# EAGLE design pic_k42 (EAGLE 9.6.2)
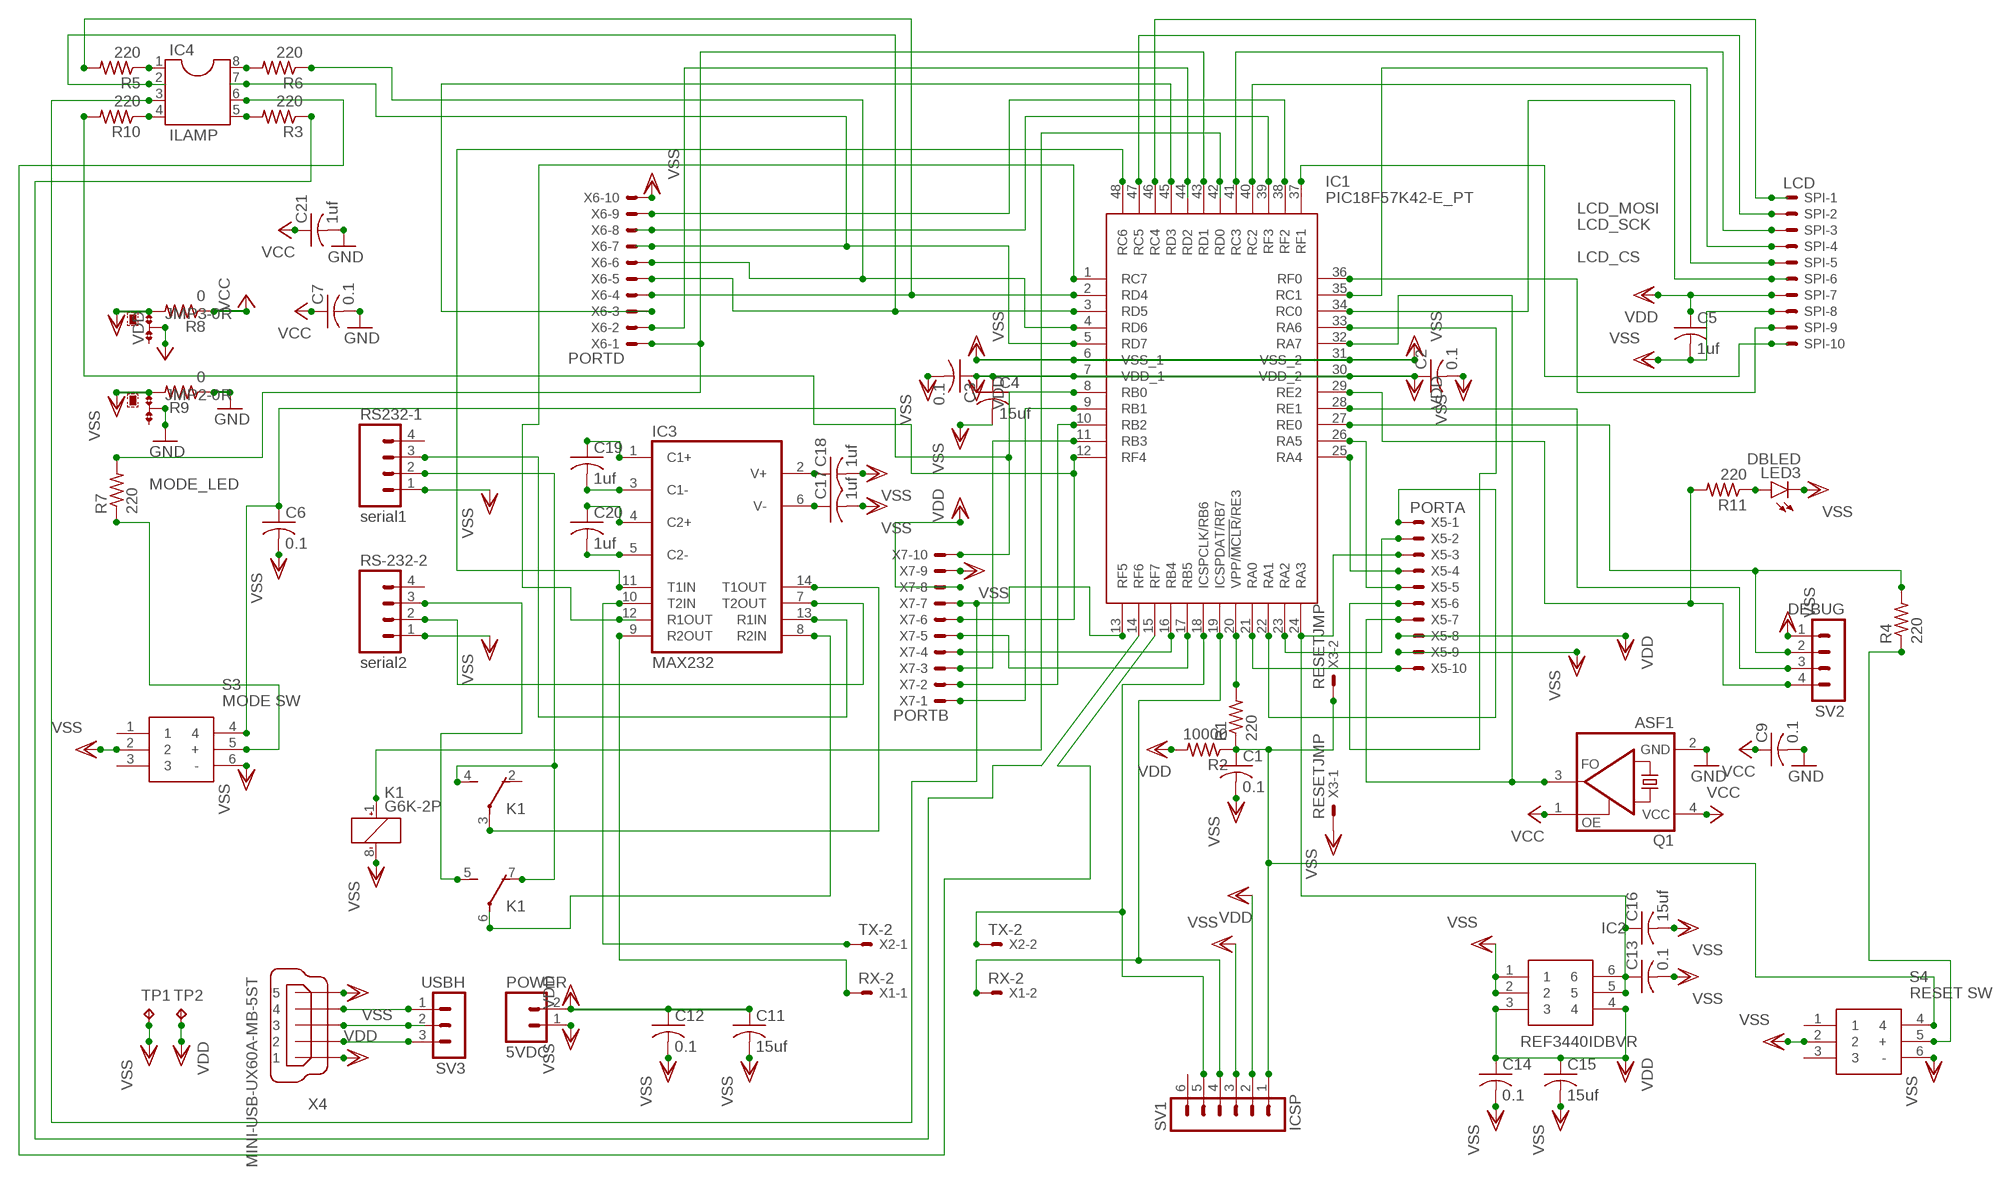
[diagram p0: schematic, sheet 1]

## Parts
C1  0.1  C-USC1206  [C1206]
C2  0.1  C-USC1206  [C1206]
C3  0.1  C-USC1206  [C1206]
C4  15uf  C-USC1206  [C1206]
C5  1uf  C-USC0805  [C0805]
C6  0.1  C-USC1206  [C1206]
C7  0.1  C-USC1206  [C1206]
C9  0.1  C-USC1206  [C1206]
C11  15uf  C-USC1206  [C1206]
C12  0.1  C-USC1206  [C1206]
C13  0.1  C-USC1206  [C1206]
C14  0.1  C-USC1206  [C1206]
C15  15uf  C-USC1206  [C1206]
C16  15uf  C-USC1206  [C1206]
C17  1uf  C-USC0805  [C0805]
C18  1uf  C-USC0805  [C0805]
C19  1uf  C-USC0805  [C0805]
C20  1uf  C-USC0805  [C0805]
C21  1uf  C-USC0805  [C0805]
IC1  PIC18F57K42-E_PT  [QFP50P900X900X120-48N]
IC2  REF3440IDBVR  [SOP95P280X145-6N]
IC3  MAX232  [DIL16]
IC4  ILAMP  DIL8S  [SOCKET-08]
JMP2  0R-JUMPA  [A0R-JMP]
JMP3  0R-JUMPA  [A0R-JMP]
K1  G6K-2P  [G6K-2P]
LED3  DBLED  LEDCHIPLED_1206  [CHIPLED_1206]
POWER  5VDC  M02  [02P]
Q1  ASF1  [ASF]
R1  220  R-US_R1206  [R1206]
R2  10000  R-US_R1206  [R1206]
R3  220  R-US_R1206  [R1206]
R4  220  R-US_R1206  [R1206]
R5  220  R-US_R1206  [R1206]
R6  220  R-US_R1206  [R1206]
R7  220  R-US_R1206  [R1206]
R8  0  R-US_R1206  [R1206]
R9  0  R-US_R1206  [R1206]
R10  220  R-US_R1206  [R1206]
R11  220  R-US_R1206  [R1206]
RS232-1  serial1  M04  [04P]
RS-232-2  serial2  M04  [04P]
S3  MODE SW  B3W-9000-Y1N  [B3W-9_1-LED]
S4  RESET SW  B3W-9000-Y1N  [B3W-9_1-LED]
SPI  LCD  22-23-2101  [22-23-2101]
SV1  ICSP  MA06-1  [MA06-1]
SV2  DEBUG  MA04-1  [MA04-1]
SV3  USBH  MA03-1  [MA03-1]
TP1  TPB1,27  [B1,27]
TP2  TPB1,27  [B1,27]
X1  RX-2  332-02  [332-02]
X2  TX-2  332-02  [332-02]
X3  RESETJMP  332-02  [332-02]
X4  MINI-USB-UX60A-MB-5ST  [UX60A-MB-5ST]
X5  PORTA  22-23-2101  [22-23-2101]
X6  PORTD  22-23-2101  [22-23-2101]
X7  PORTB  22-23-2101  [22-23-2101]

## Nets
GND: C7.2 C9.2 C21.2 JMP2.2 Q1.2(GND) R9.1
LCD_CS: IC1.40(RC2) SPI.5
LCD_MOSI: IC1.47(RC5) SPI.2
LCD_SCK: IC1.41(RC3) SPI.3
MODE_LED: IC1.43(RD1) R7.2 X6.1
N$1: C1.1 R1.1 R2.1 S4.4 SV1.1 X3.2
N$2: IC1.20(VPP/!MCLR!/RE3) R1.2
N$3: IC4.1 R5.1
N$4: IC1.32(RA7) Q1.3(FO) X5.7
N$5: C17.1 IC3.6(V-)
N$6: IC1.19(ICSPDAT/RB7) SV1.4 X1.2
N$7: IC1.18(ICSPCLK/RB6) SV1.5 X2.2
N$8: C13.1 C16.1 IC1.24(RA3) IC2.5 IC2.6 X5.3
N$9: C18.1 IC3.2(V+)
N$10: C19.1 IC3.1(C1+)
N$11: C20.1 IC3.4(C2+)
N$12: C20.2 IC3.5(C2-)
N$13: C19.2 IC3.3(C1-)
N$14: K1.4(2:S) K1.7(3:O) RS232-1.2
N$15: IC3.7(T2OUT) RS-232-2.2
N$16: IC3.13(R1IN) RS232-1.3
N$17: IC4.8 R6.2
N$18: IC1.1(RC7) IC3.12(R1OUT)
N$19: IC3.9(R2OUT) X1.1
N$20: IC1.48(RC6) IC3.11(T1IN)
N$21: R4.1 S4.5(+)
N$22: IC3.10(T2IN) X2.1
N$23: IC1.27(RE0) R4.2 SV2.2
N$24: IC1.28(RE1) SV2.3
N$25: IC1.29(RE2) R11.2 SV2.4
N$26: IC3.14(T1OUT) K1.3(2:P)
N$27: IC3.8(R2IN) K1.6(3:P)
N$28: IC1.42(RD0) K1.1(1:+)
N$29: IC1.46(RC4) SPI.1
N$32: IC1.35(RC1) SPI.4
N$34: IC1.34(RC0) SPI.6
N$35: IC1.26(RA5) X5.5
N$36: IC1.25(RA4) X5.4
N$37: IC1.23(RA2) X5.2
N$38: IC1.22(RA1) X5.1
N$39: IC1.21(RA0) X5.10
N$40: IC1.33(RA6) X5.6
N$41: IC1.36(RF0) SPI.9
N$42: IC1.37(RF1) SPI.10
N$43: C6.1 IC1.8(RB0) S3.4 X7.10
N$44: IC1.44(RD2) X6.2
N$45: IC1.45(RD3) X6.3
N$46: IC1.2(RD4) R5.2 X6.4
N$47: IC1.3(RD5) IC4.2 X6.5
N$48: IC1.4(RD6) R6.1 X6.6
N$49: IC1.5(RD7) IC4.7 X6.7
N$50: IC1.38(RF2) X6.9
N$51: IC1.39(RF3) X6.8
N$53: IC1.9(RB1) X7.1
N$54: IC1.10(RB2) X7.2
N$55: IC4.5 R3.2
N$56: IC1.16(RB4) X7.4
N$57: IC1.17(RB5) X7.5
N$58: IC1.12(RF4) R10.2 X7.6
N$59: IC1.13(RF5) IC4.3 X7.7
N$60: IC1.15(RF7) IC4.6
N$61: IC1.14(RF6) R3.1
N$62: K1.5(3:S) RS-232-2.3
N$63: IC4.4 R10.1
N$64: R7.1 S3.5(+)
N$65: LED3.A R11.1
N$66: IC1.11(RB3) X7.3
N$67: SV3.1 X4.4
N$68: SV3.2 X4.3
N$69: SV3.3 X4.2
VCC: C7.1 C9.1 C21.1 JMP3.2 Q1.1(OE) Q1.4(VCC) R8.1
VDD: C2.1 C3.1 C4.1 C5.1 C11.1 C12.1 C14.1 C15.1 IC1.7(VDD_1) IC1.30(VDD_2) IC2.3 IC2.4 JMP3.1 POWER.2 R2.2 R8.2 SPI.7 SV1.2 TP2.TP X4.1 X5.8 X7.8
VSS: C1.2 C2.2 C3.2 C4.2 C5.2 C6.2 C11.2 C12.2 C13.2 C14.2 C15.2 C16.2 C17.2 C18.2 IC1.6(VSS_1) IC1.31(VSS_2) IC2.1 IC2.2 JMP2.1 K1.8(1:-) LED3.C POWER.1 R9.2 RS232-1.1 RS-232-2.1 S3.2 S3.6(-) S4.2 S4.6(-) SPI.8 SV1.3 SV2.1 TP1.TP X3.1 X4.5 X5.9 X6.10 X7.9
Unconnected: JMP2.3 JMP3.3 K1.2(2:O) RS232-1.4 RS-232-2.4 S3.1 S3.3 S4.1 S4.3 SV1.6

## Power pins joined to a net without a drawn wire
GND: IC3.15(GND)
VCC: IC3.16(VCC)

## Library data of the parts
C1-C7 C9 C11-C21 = rcl:C-US: CAPACITOR, American symbol; SPICEPREFIX: C
IC1 = SamacSys_Parts:PIC18F57K42-E_PT: 8-bit Microcontrollers - MCU 128KB Flash, 8KB RAM, 256B EEPROM, 12-bit ADC2, Vector Interrupts, DMA, MAP, DIA, DAC, Comp, PWM, CWG, HLT, WWDT, SCAN/CRC, ZCD, PPS, EUSART, SPI/I2C, IDLE/DOZE/PMD Source: Datasheet; DESCRIPTION: 8-bit Microcontrollers - MCU 128KB Flash, 8KB RAM, 256B EEPROM, 12-bit ADC2, Vector Interrupts, DMA, MAP, DIA, DAC, Comp, PWM, CWG, HLT, WWDT, SCAN/CRC, ZCD, PPS, EUSART, SPI/I2C, IDLE/DOZE/PMD; HEIGHT: 1.2mm; MANUFACTURER_NAME: Microchip; MANUFACTURER_PART_NUMBER: PIC18F57K42-E/PT; MOUSER_PART_NUMBER: 579-PIC18F57K42-E/PT
IC2 = SamacSys_Parts:REF3440IDBVR: 4.1V Low-Drift Low-Power Small-Footprint Series Voltage Reference Source: Datasheet; DESCRIPTION: 4.1V Low-Drift Low-Power Small-Footprint Series Voltage Reference; HEIGHT: 1.45mm; MANUFACTURER_NAME: Texas Instruments; MANUFACTURER_PART_NUMBER: REF3440IDBVR
IC3 = maxim:MAX232: RS232 TRANSCEIVER; MF: MAXIM; MPN: MAX232ACPE+; OC_FARNELL: 9723773; OC_NEWARK: 68K4544
IC4 = ic-package:DIL8: Dual In Line / Socket
JMP2 JMP3 = jump-0r-smd:0R-JUMP: SMD 0R 0805 Jumper
K1 = relay:G6K: Low Signal Relay oeiwcsnts1.omron.com/.. D20G6K0100.pdf; MF: OMRON COMPONENTS USA; MPN: G6K-2P DC3; OC_FARNELL: 3937276; OC_NEWARK: 89C6482
LED3 = led:LED: LED OSRAM: - CHIPLED LG R971, LG N971, LY N971, LG Q971, LY Q971, LO R971, LY R971 LH N974, LH R974 LS Q976, LO Q976, LY Q976 LO Q996 - Hyper CHIPLED LW Q18S LB Q993, LB Q99A, LB R99A - SideLED LS A670, LO A670, LY A670, LG A670, LP A670 LB A673, LV A673, LT A673, LW A673 LH A674 LY A675 LS A676, LA A676, LO A676, LY A676, LW A676 LS A679, LY A679, LG A679 - Hyper Micro SIDELED® LS Y876, LA Y876, LO Y876, LY Y876 LT Y87S - SmartLED LW L88C, LW L88S LB L89C, LB L89S, LG L890 LS L89K, LO L89K, LY L89K LS L896, LA L896, LO L896, LY L896 - TOPLED LS T670, LO T670, LY T670, LG T670, LP T670 LSG T670, LSP T670, LSY T670, LOP T670, LYG T670 LG T671, LOG T671, LSG T671 LB T673, LV T673, LT T673, LW T673 LH T674 LS T676, LA T676, LO T676, LY T676, LB T676, LH T676, LSB T676, LW T676 LB T67C, LV T67C, LT T67C, LS T67K, LO T67K, LY T67K, LW E67C LS E67B, LA E67B, LO E67B, LY E67B, LB E67C, LV E67C, LT E67C LW T67C LS T679, LY T679, LG T679 LS T770, LO T770, LY T770, LG T770, LP T770 LB T773, LV T773, LT T773, LW T773 LH T774 LS E675, LA E675, LY E675, LS T675 LS T776, LA T776, LO T776, LY T776, LB T776 LHGB T686 LT T68C, LB T68C - Hyper Mini TOPLED® LB M676 - Mini TOPLED Santana® LG M470 LS M47K, LO M47K, LY M47K Source: http://www.osram.convergy.de LUXEON: - LUMILED® LXK2-PW12-R00, LXK2-PW12-S00, LXK2-PW14-U00, LXK2-PW14-V00 LXK2-PM12-R00, LXK2-PM12-S00, LXK2-PM14-U00 LXK2-PE12-Q00, LXK2-PE12-R00, LXK2-PE12-S00, LXK2-PE14-T00, LXK2-PE14-U00 LXK2-PB12-K00, LXK2-PB12-L00, LXK2-PB12-M00, LXK2-PB14-N00, LXK2-PB14-P00, LXK2-PB14-Q00 LXK2-PR12-L00, LXK2-PR12-M00, LXK2-PR14-Q00, LXK2-PR14-R00 LXK2-PD12-Q00, LXK2-PD12-R00, LXK2-PD12-S00 LXK2-PH12-R00, LXK2-PH12-S00 LXK2-PL12-P00, LXK2-PL12-Q00, LXK2-PL12-R00 Source: www.luxeon.com KINGBRIGHT: KA-3528ASYC Source: www.kingbright.com
POWER = con-amp-quick:M02: AMP QUICK CONNECTOR; OC_FARNELL: unknown; OC_NEWARK: unknown
Q1 = crystal:ASF*: CRYSTAL CLOCK OSCILLATORS 5.0 Vdc or 3.3 Vdc - LOW PROFILE ULTRA MINIATURE CERAMIC SURFACE MOUNT Source: http://www.abracon.com/Oscillators/asf1-L-L1.pdf; OC_FARNELL: unknown; OC_NEWARK: unknown
R1-R11 = rcl:R-US_: RESISTOR, American symbol; SPICEPREFIX: R
RS232-1 RS-232-2 = con-amp-quick:M04: AMP QUICK CONNECTOR; OC_FARNELL: unknown; OC_NEWARK: unknown
S3 S4 = SamacSys_Parts:B3W-9000-Y1N: Illuminated Tactile Switches Illuminated Ylw LED White Cap Source: Datasheet; ALLIED_NUMBER: 70176005; ALLIED_PRICE-STOCK: https://www.alliedelec.com/omron-electronic-components-b3w-9000-y1n/70176005/; DESCRIPTION: Illuminated Tactile Switches Illuminated Ylw LED White Cap; HEIGHT: mm; MANUFACTURER_NAME: Omron Electronics; MANUFACTURER_PART_NUMBER: B3W-9000-Y1N; MOUSER_PART_NUMBER: 653-B3W-9000-Y1N; MOUSER_PRICE-STOCK: https://www.mouser.com/Search/Refine.aspx?Keyword=653-B3W-9000-Y1N; RS_PART_NUMBER: 0492777P; RS_PRICE-STOCK: http://uk.rs-online.com/web/p/products/0492777P
SPI X5-X7 = con-molex:22-23-2101: .100" (2.54mm) Center Header - 10 Pin; MF: MOLEX; MPN: 22-23-2101; OC_FARNELL: 1756828; OC_NEWARK: 94C0765
SV1 = con-lstb:MA06-1: PIN HEADER; OC_FARNELL: unknown; OC_NEWARK: unknown
SV2 = con-lstb:MA04-1: PIN HEADER; OC_FARNELL: unknown; OC_NEWARK: unknown
SV3 = con-lstb:MA03-1: PIN HEADER; OC_FARNELL: unknown; OC_NEWARK: unknown
TP1 TP2 = testpad:TP: Test pad
X1-X3 = con-garry:332-02: 2 Pin - 2mm Dual Row Source: www.mpe-connector.de / garry_shortform_2012.pdf
X4 = con-hirose:MINI-USB-: MINI USB Connector Source: http://www.hirose.co.jp/cataloge_hp/e24000019.pdf; OC_FARNELL: unknown; OC_NEWARK: unknown

## Board
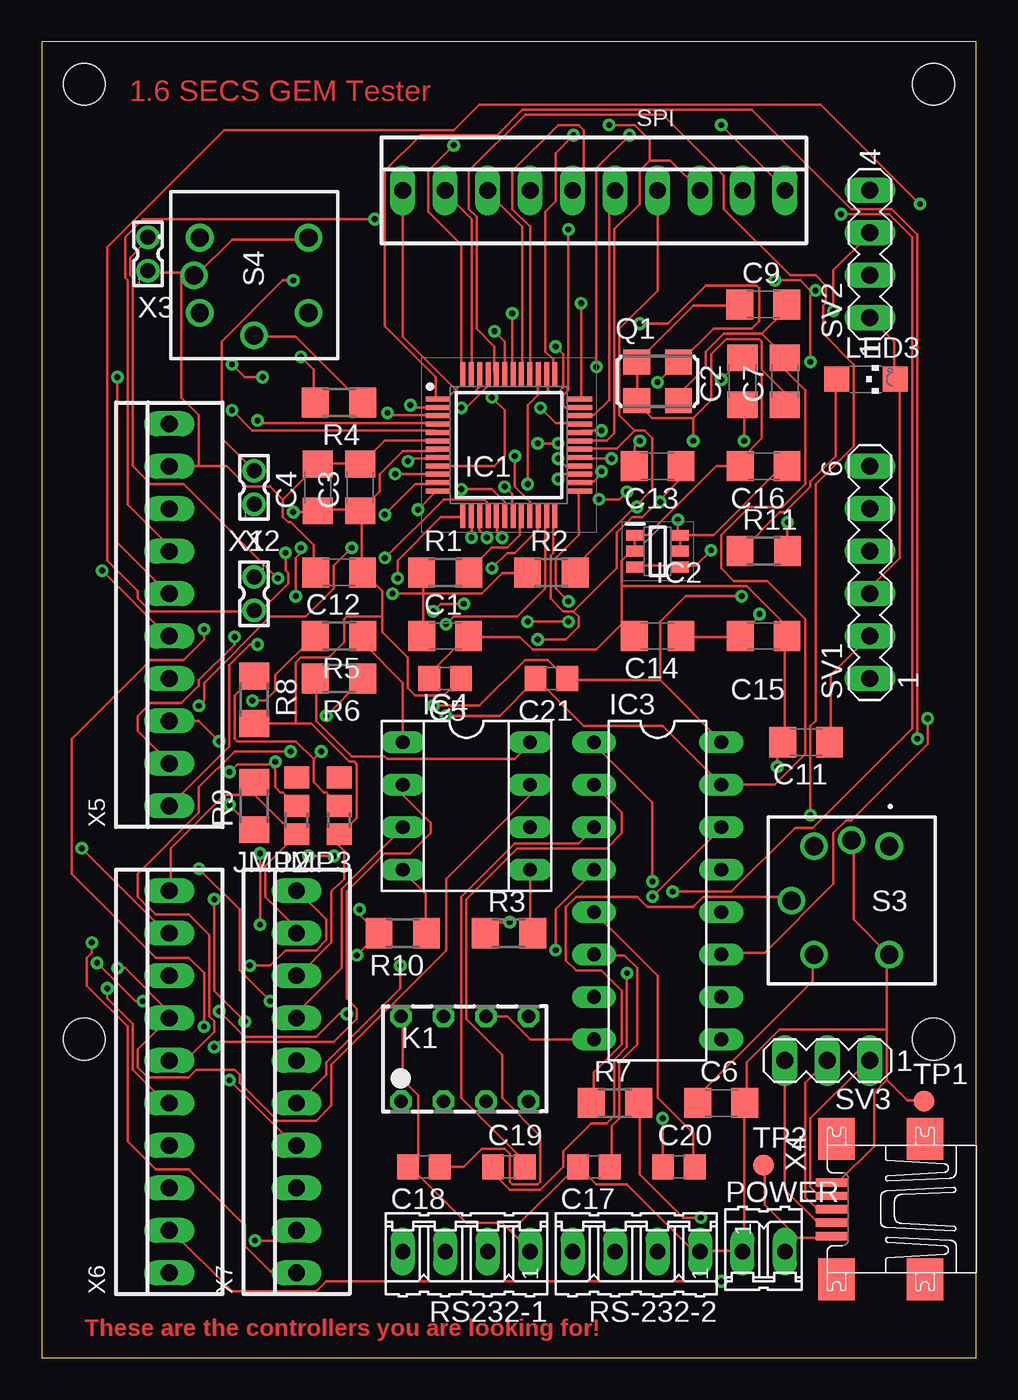
[diagram p1: board, top side]
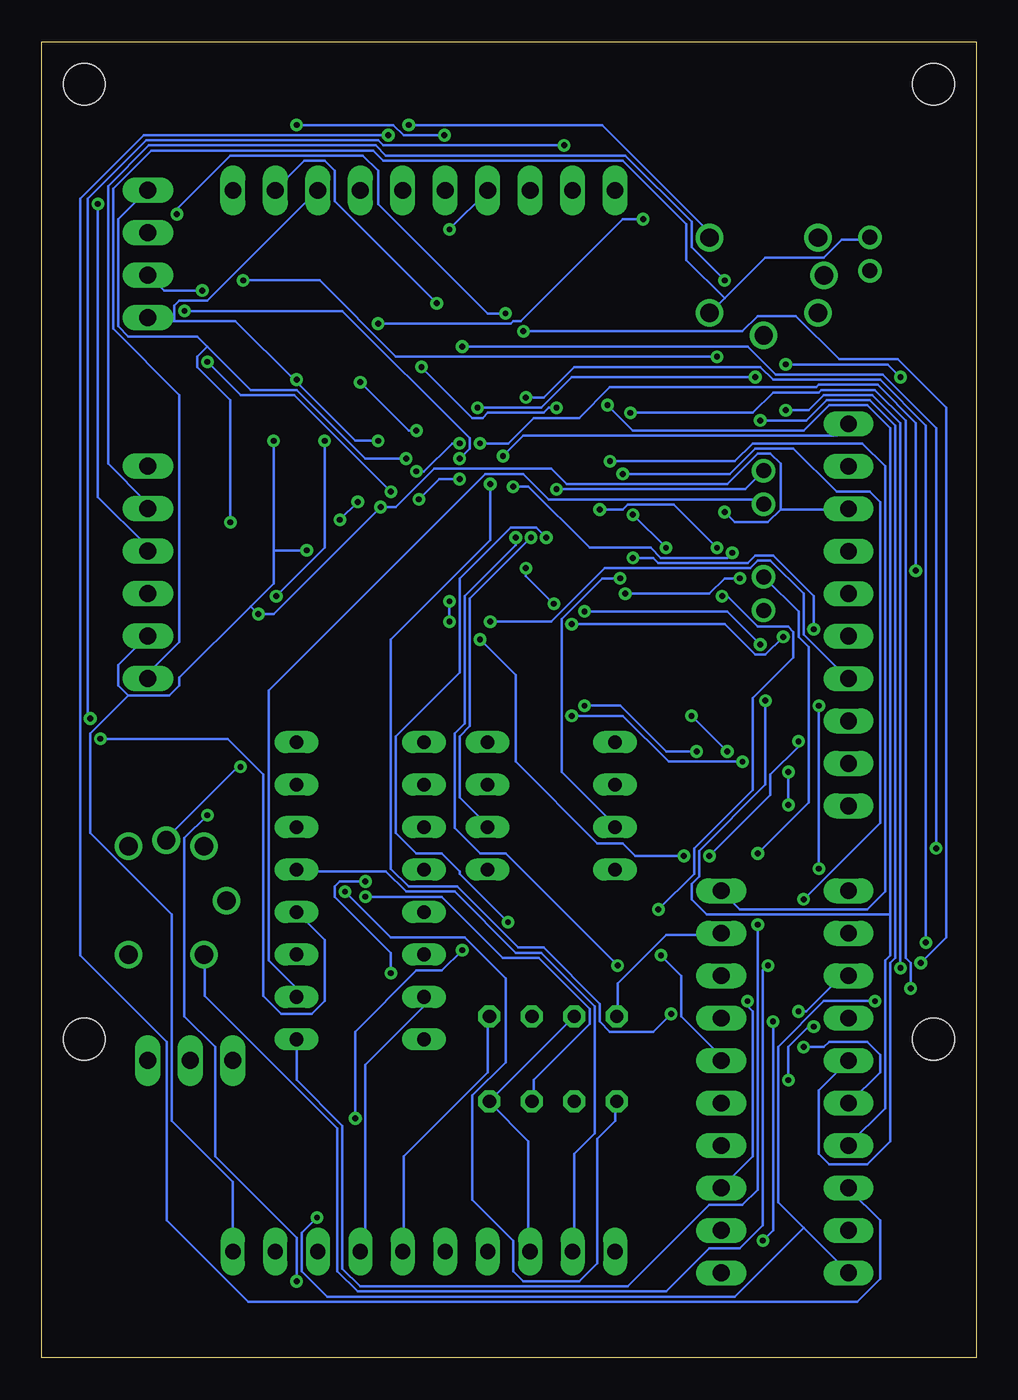
[diagram p2: board, bottom side, seen from below]

Size 55.88 x 78.74 mm. Coordinates in mm from the lower left corner, seen from the top.
Outline: 0,0 55.88,0 55.88,78.74 0,78.74 0,0
Copper layers (1*16): Top 0.035mm / dielectric 1.5mm / Bottom 0.035mm
Design rules "default": minimum track width 6mil, minimum drill 0.35mm, track to track 6mil, track to pad 6mil, pad to pad 6mil, via to via 6mil, smd to smd 6mil, copper to edge 40mil, drill to drill 6mil, minimum pad ring 10mil, minimum via ring 8mil, stop-mask expansion 4mil, vias tented up to drill 0mil, thermal gap 10mil
Holes 2.5 mm at 2.54,76.2 53.34,76.2 2.54,19.05 53.34,19.05

### Footprints (pad centres in the part's own frame; a part is rotated, then mirrored left to right if it is on the bottom)
C1206 = smd 1.6 x 1.8: 1 -1.4,0; 2 1.4,0
C0805 = smd 1.3 x 1.5: 1 -0.95,0; 2 0.95,0
QFP50P900X900X120-48N = smd 1.475 x 0.3: 1 -4.238,2.75; 2 -4.238,2.25; 3 -4.238,1.75; 4 -4.238,1.25; 5 -4.238,0.75; 6 -4.238,0.25; 7 -4.238,-0.25; 8 -4.238,-0.75; 9 -4.238,-1.25; 10 -4.238,-1.75; 11 -4.238,-2.25; 12 -4.238,-2.75; 25 4.238,-2.75; 26 4.238,-2.25; 27 4.238,-1.75; 28 4.238,-1.25; 29 4.238,-0.75; 30 4.238,-0.25; 31 4.238,0.25; 32 4.238,0.75; 33 4.238,1.25; 34 4.238,1.75; 35 4.238,2.25; 36 4.238,2.75 | smd 0.3 x 1.475: 13 -2.75,-4.238; 14 -2.25,-4.238; 15 -1.75,-4.238; 16 -1.25,-4.238; 17 -0.75,-4.238; 18 -0.25,-4.238; 19 0.25,-4.238; 20 0.75,-4.238; 21 1.25,-4.238; 22 1.75,-4.238; 23 2.25,-4.238; 24 2.75,-4.238; 37 2.75,4.238; 38 2.25,4.238; 39 1.75,4.238; 40 1.25,4.238; 41 0.75,4.238; 42 0.25,4.238; 43 -0.25,4.238; 44 -0.75,4.238; 45 -1.25,4.238; 46 -1.75,4.238; 47 -2.25,4.238; 48 -2.75,4.238
SOP95P280X145-6N = smd 1.075 x 0.65: 1 -1.338,0.95; 2 -1.338,0; 3 -1.338,-0.95; 4 1.338,-0.95; 5 1.338,0; 6 1.338,0.95
DIL16 = drill 0.813 long: 1 -8.89,-3.81; 2 -6.35,-3.81; 3 -3.81,-3.81; 4 -1.27,-3.81; 5 1.27,-3.81; 6 3.81,-3.81; 7 6.35,-3.81; 8 8.89,-3.81; 9 8.89,3.81; 10 6.35,3.81; 11 3.81,3.81; 12 1.27,3.81; 13 -1.27,3.81; 14 -3.81,3.81; 15 -6.35,3.81; 16 -8.89,3.81
SOCKET-08 = drill 0.813 long: 1 -3.81,-3.81; 2 -1.27,-3.81; 3 1.27,-3.81; 4 3.81,-3.81; 5 3.81,3.81; 6 1.27,3.81; 7 -1.27,3.81; 8 -3.81,3.81
A0R-JMP = smd 1.5 x 1.3: 1 0,1.7; 2 0,0; 3 0,-1.7
G6K-2P = drill 0.8 octagon: 1 -2.54,-2.54; 2 0,-2.54; 3 2.54,-2.54; 4 5.08,-2.54; 5 5.08,2.54; 6 2.54,2.54; 7 0,2.54; 8 -2.54,2.54
CHIPLED_1206 = smd 1.5 x 1.5: A 0,-1.75; C 0,1.75
02P = drill 0.914 long: 1 -1.27,0; 2 1.27,0
ASF = smd 1.6 x 1.5: 1 -1.25,-1.15; 2 1.25,-1.15; 3 1.25,1.15; 4 -1.25,1.15
R1206 = smd 1.6 x 1.803: 1 -1.422,0; 2 1.422,0
04P = drill 0.914 long: 1 -3.81,0; 2 -1.27,0; 3 1.27,0; 4 3.81,0
B3W-9_1-LED = drill 1.1 pad 1.65: 1 3.25,-2.25; 2 -3.25,-2.25; 3 3.25,2.25; 4 -3.25,2.25; 5 0,3.6; 6 3.6,0
22-23-2101 = drill 1 long: 1 -11.43,0; 2 -8.89,0; 3 -6.35,0; 4 -3.81,0; 5 -1.27,0; 6 1.27,0; 7 3.81,0; 8 6.35,0; 9 8.89,0; 10 11.43,0
MA06-1 = drill 1.016 long: 1 -6.35,0; 2 -3.81,0; 3 -1.27,0; 4 1.27,0; 5 3.81,0; 6 6.35,0
MA04-1 = drill 1.016 long: 1 -3.81,0; 2 -1.27,0; 3 1.27,0; 4 3.81,0
MA03-1 = drill 1.016 long: 1 -2.54,0; 2 0,0; 3 2.54,0
B1,27 = smd 1.27 x 1.27: TP 0,0
332-02 = drill 0.9 pad 1.27: 1 0,-1; 2 0,1
UX60A-MB-5ST = smd 2 x 0.5: 1 2.25,1.6; 2 2.25,0.8; 3 2.25,0; 4 2.25,-0.8; 5 2.25,-1.6 | smd 2.2 x 2.5: M1 -3.3,-4.2; M2 -3.3,4.2; M3 2,4.2; M4 2,-4.2

### Placement (x,y rotation side)
C1  24.13,43.18 0 top
C2  41.91,58.42 90 top
C3  19.05,52.07 90 top
C4  16.51,52.07 90 top
C5  24.13,40.64 180 top
C6  40.64,15.24 0 top
C7  44.45,58.42 90 top
C9  43.15,63.02 0 top
C11  45.72,36.83 180 top
C12  17.78,46.99 180 top
C13  36.83,53.34 180 top
C14  36.83,43.18 180 top
C15  43.18,43.18 0 top
C16  43.18,53.34 180 top
C17  33.02,11.43 180 top
C18  22.86,11.43 180 top
C19  27.94,11.43 0 top
C20  38.1,11.43 0 top
C21  30.48,40.64 180 top
IC1  27.94,54.61 0 top
IC2  36.83,48.26 0 top
IC3  36.83,27.94 270 top
IC4  25.4,33.02 270 top
JMP2  15.24,33.02 180 top
JMP3  17.78,33.02 180 top
K1  24.03,17.88 0 top
LED3  49.3,58.55 270 top
POWER  43.18,6.35 0 top
Q1  36.83,58.42 0 top
R1  24.13,46.99 0 top
R2  30.48,46.99 0 top
R3  27.94,25.4 0 top
R4  17.78,57.15 180 top
R5  17.78,43.18 180 top
R6  17.78,40.64 180 top
R7  34.29,15.24 0 top
R8  12.7,39.37 270 top
R9  12.7,33.02 90 top
R10  21.59,25.4 180 top
R11  43.18,48.26 0 top
RS232-1  25.4,6.35 180 top
RS-232-2  35.56,6.35 180 top
S3  48.44,27.36 90 top
S4  12.7,64.77 180 top
SPI  33.02,69.85 0 top
SV1  49.53,46.99 90 top
SV2  49.53,66.04 90 top
SV3  46.99,17.78 180 top
TP1  52.76,15.34 0 top
TP2  43.15,11.53 0 top
X1  12.7,45.72 180 top
X2  12.7,52.07 0 top
X3  6.35,66.04 0 top
X4  49.53,8.89 180 top
X5  7.62,44.45 90 top
X6  7.62,16.51 90 top
X7  15.24,16.51 90 top

### Tracks (layer width: path | path; a pad name or v marks a point on that pad's centre or on a via)
GND  (via drill 0.35)
  Top 0.152: 43.08,61.27 40.79,61.27 39.73,60.2 39.73,59.28 38.2,57.76 38.2,57.3 Q1.2 | 43.08,61.27 44.45,59.89 C7.2 44.45,59.13 45.67,57.91 45.67,52.27 44.3,50.9 42.32,50.9 40.64,49.23 40.64,47.24 41.4,46.48 43.38,46.48 45.67,44.2 45.67,36.12 43.84,34.29 IC3.15 37.14,37.8 32.41,37.8 29.67,40.54 C21.2 29.52,40.54 27.38,38.41 v24.18,38.41 | 43.08,61.27 44.45,62.64 44.45,62.94 C9.2 | JMP2.2 14.43,33.83 14.28,33.83 13.97,34.14 13.97,35.2 13.82,35.36 | 13.82,35.36 13.67,35.51 11.68,35.51 v11.23,35.05 | v11.23,33.07 12.6,31.7 R9.1 | 13.82,35.36 13.82,35.51 v13.97,35.66
  Bottom 0.152: v11.23,33.07 v11.23,35.05 | v13.97,35.66 18.39,35.66 21.13,38.41 v24.18,38.41
LCD_CS
  Top 0.152: IC1.40 29.21,58.98 29.21,67.67 28.14,68.73 28.14,71.02 30.89,73.76 32.11,73.76 32.41,73.46 32.41,70.56 31.8,69.95 SPI.5
LCD_MOSI
  Top 0.152: IC1.47 25.71,58.98 25.71,68.12 24.03,69.8 SPI.2
LCD_SCK
  Top 0.152: IC1.41 28.75,58.98 28.75,67.67 26.62,69.8 SPI.3
MODE_LED  (via drill 0.35)
  Top 0.152: v27.08,61.42 27.69,60.81 27.69,58.98 IC1.43 | v3.3,23.62 5.59,21.34 v6.05,21.34 | v39.42,8.38 38.35,8.38 35.76,10.97 35.76,15.24 R7.2
  Bottom 0.152: v27.08,61.42 13.97,61.42 13.06,62.33 10.77,62.33 8.18,59.74 4.67,59.74 1.78,56.84 1.78,25.15 v3.3,23.62 | v6.05,21.34 9.09,21.34 11.84,18.59 11.84,9.3 10.31,7.77 | X6.1 10.31,7.77 | v39.42,8.38 40.34,7.47 40.34,5.18 38.81,3.66 14.43,3.66 10.31,7.77
N$1  (via drill 0.35)
  Top 0.152: 22.81,45.72 22.81,46.94 R1.1 | 22.81,45.72 22.81,43.28 C1.1 | 22.81,45.72 26.31,45.72 27.53,46.94 29.06,46.94 R2.1 | v20.98,45.72 22.81,45.72 | v14.12,46.63 8.48,52.27 6.5,52.27 5.44,53.34 5.44,64.62 5.28,64.77 5.28,65.84 6.35,66.9 X3.2
  Bottom 0.152: 15.04,63.4 15.8,62.64 S4.4 | 15.04,63.4 12.6,65.84 9.09,65.84 8.03,66.9 6.35,66.9 X3.2 | 15.04,63.4 17.32,65.68 17.32,67.82 21.13,71.63 35.46,71.63 36.07,72.24 49.33,72.24 51.61,69.95 51.61,61.57 47.65,57.61 47.65,42.82 49.48,41 49.48,40.69 SV1.1 | v20.98,45.72 15.95,45.72 15.04,46.63 v14.12,46.63
N$2
  Top 0.152: IC1.20 28.6,50.29 28.6,49.23 27.84,48.46 26.92,48.46 25.55,47.09 R1.2
N$3
  Top 0.152: IC4.1 21.59,40.39 19.3,42.67 19.3,43.13 R5.1
N$4  (via drill 0.35)
  Top 0.152: v33.48,55.47 32.26,55.47 IC1.32 | v36.83,58.37 38.05,59.59 Q1.3 38.2,59.59 40.18,61.57 42.47,61.57 42.93,62.03 42.93,64.01 42.77,64.16 39.73,64.16 37.44,61.87 v35.76,61.87 | v19.91,68.12 6.05,68.12 4.98,67.06 4.98,64.62 5.13,64.47 5.13,51.05 7.57,48.62 7.57,48.31 X5.7
  Bottom 0.152: v33.48,55.47 33.93,55.47 v36.83,58.37 | v19.91,68.12 21.13,68.12 27.23,62.03 27.69,62.03 27.84,61.87 v35.76,61.87
N$5
  Top 0.152: C17.1 34.09,11.43 34.09,13.87 34.54,14.33 34.54,17.68 35.61,18.75 35.61,23.32 34.85,24.08 33.02,24.08 IC3.6
N$6  (via drill 0.35)
  Top 0.152: v27.69,52.12 28.14,51.66 28.14,50.44 IC1.19 | v14.58,48.16 14.58,47.09 14.73,46.94 14.73,46.33 13.21,44.81 12.75,44.81 X1.2 12.6,44.65 6.5,44.65 5.74,45.41 5.74,45.87 3.91,47.7 3.91,66.45 10.92,73.46 24.64,73.46 26.16,74.98 46.58,74.98 v52.53,69.04
  Bottom 0.152: v27.69,52.12 26.77,52.12 23.11,48.46 19.46,48.46 18.85,47.85 14.88,47.85 v14.58,48.16 | v52.53,69.04 52.53,51.51 49.63,48.62 49.63,48.31 SV1.4
N$7  (via drill 0.35)
  Top 0.152: v25.1,51.97 26.92,51.97 27.69,51.21 27.69,50.44 IC1.18 | v15.04,64.47 14.43,64.47 10.77,60.81 10.77,55.02 12.6,53.19 X2.2
  Bottom 0.152: v25.1,51.97 13.82,51.97 12.75,53.04 X2.2 | v15.04,64.47 17.02,66.45 17.02,67.97 20.98,71.93 35.31,71.93 35.92,72.54 49.48,72.54 51.92,70.1 51.92,53.49 49.63,51.21 49.63,50.9 SV1.5
N$8  (via drill 0.35)
  Top 0.152: IC2.5 38.2,48.31 38.2,49.07 IC2.6 | C16.1 44.3,53.34 40.18,49.23 38.2,49.23 IC2.6 | 31.8,44.65 31.19,44.65 30.43,45.41 30.43,48.01 30.58,48.16 30.58,50.29 IC1.24 | 31.8,44.65 34.39,47.24 34.39,49.38 35.31,50.29 35.92,50.29 36.83,51.21 | 36.83,51.21 38.2,52.58 38.2,53.34 C13.1 | X5.3 9.4,38.1 v10.62,36.88 | v17.47,30.02 v15.95,30.02 | v29.67,42.98 31.34,42.98 32.11,43.74 32.11,44.35 31.8,44.65 | v38.05,50.14 38.05,49.23 IC2.6 | 36.83,51.21 v36.98,51.21
  Bottom 0.152: v10.62,36.88 10.62,36.58 12.29,34.9 12.29,33.68 v15.95,30.02 | v17.47,30.02 20.37,30.02 21.13,30.79 22.66,30.79 27.53,35.66 27.53,40.84 v29.67,42.98 | v36.98,51.21 v38.05,50.14
N$9
  Top 0.152: C18.1 25.25,11.43 26.31,12.5 27.69,12.5 27.99,12.19 27.99,10.52 28.14,10.36 29.67,10.36 29.82,10.52 29.82,13.26 27.53,15.54 27.53,18.14 25.4,20.27 25.4,27.43 28.45,30.48 33.78,30.48 34.7,31.39 34.7,32.61 IC3.2
N$10  (via drill 0.35)
  Top 0.152: v35,23.01 35,18.59 34.24,17.83 34.24,14.48 33.78,14.02 32.87,14.02 31.19,12.34 31.19,11.43 29.82,10.06 27.99,10.06 27.08,10.97 27.08,11.43 C19.1 | v36.53,28.5 36.53,33.22 33.02,36.73 IC3.1
  Bottom 0.152: v35,23.01 35,24.23 38.35,27.58 38.35,28.19 38.05,28.5 v36.53,28.5
N$11  (via drill 0.35)
  Top 0.152: v37.14,14.33 37.14,11.43 C20.1 | v30.73,24.38 30.73,26.82 33.02,29.11 IC3.4
  Bottom 0.152: v37.14,14.33 37.14,19.51 33.48,23.16 31.95,23.16 v30.73,24.38
N$12
  Top 0.152: IC3.5 36.83,22.86 36.83,15.54 38.96,13.41 38.96,11.43 C20.2
N$13
  Top 0.152: C19.2 28.75,11.43 28.75,11.89 25.1,15.54 25.1,27.58 28.3,30.79 32.11,30.79 33.02,31.7 IC3.3
N$14
  Bottom 0.152: K1.7 K1.4 29.06,15.24 26.77,12.95 26.77,6.4 RS232-1.2
N$15
  Bottom 0.152: IC3.7 33.02,21.03 36.53,17.53 36.53,6.71 36.83,6.4 RS-232-2.2
N$16
  Bottom 0.152: IC3.13 40.64,29.11 35.31,29.11 34.09,27.89 31.19,27.89 27.53,24.23 26.01,24.23 22.81,21.03 22.81,13.41 24.03,12.19 24.03,6.4 RS232-1.3
N$17
  Top 0.152: R6.2 16.41,40.54 16.41,38.1 18.54,35.97 20.52,35.97 20.68,35.81 28.3,35.81 29.21,36.73 IC4.8
N$18  (via drill 0.35)
  Top 0.152: v52.38,37.03 52.38,67.21 50.85,68.73 48.41,68.73 42.47,74.68 28.75,74.68 27.23,73.15 22.66,73.15 20.52,71.02 20.52,61.72 23.57,58.67 23.57,57.46 IC1.1
  Bottom 0.152: v52.38,37.03 44.76,37.03 42.62,34.9 42.62,21.64 41.55,20.57 39.73,20.57 38.96,21.34 38.96,24.99 IC3.12
N$19  (via drill 0.35)
  Top 0.152: v13.06,30.17 v13.06,25.91
  Bottom 0.152: IC3.9 40.64,16.61 37.9,13.87 37.9,5.33 36.83,4.27 20.83,4.27 15.95,9.14 13.97,9.14 13.06,10.06 v13.06,25.91 | v13.06,30.17 10.01,33.22 10.01,42.52 10.62,43.13 10.62,44.65 12.6,46.63 X1.1
N$20  (via drill 0.35)
  Top 0.152: v24.64,72.54 23.11,71.02 23.11,68.58 25.1,66.6 25.1,58.98 IC1.48 | v52.98,38.25 52.98,36.73 48.41,32.16 48.11,32.16 47.35,31.39 47.35,28.35 43.23,24.23 40.64,24.23 IC3.11
  Bottom 0.152: v24.64,72.54 35.46,72.54 35.76,72.85 49.63,72.85 53.14,69.34 53.14,38.41 v52.98,38.25
N$21
  Top 0.152: R4.1 19.15,57.15 15.19,61.11 12.75,61.11 S4.5
N$22
  Bottom 0.152: IC3.10 40.64,22.1 42.32,23.77 42.32,39.93 29.36,52.88 27.08,52.88 25.55,51.36 12.9,51.36 12.75,51.21 X2.1
N$23  (via drill 0.35)
  Top 0.152: v30.89,52.58 31.19,52.88 32.11,52.88 IC1.27 | v33.33,51.36 34.54,51.36 v35,51.82 | v45.97,59.59 45.97,63.55 46.13,63.7 | v15.49,59.89 16.26,59.13 16.26,57.15 R4.2 | v43.84,64.47 45.36,64.47 46.13,63.7 | 46.13,63.7 v46.28,63.86
  Bottom 0.152: v30.89,52.58 32.11,52.58 v33.33,51.36 | v35,51.82 40.79,57.61 43.99,57.61 v45.97,59.59 | v46.28,63.86 48.56,63.86 49.48,64.77 SV2.2 | v15.49,59.89 34.7,59.89 39.27,64.47 v43.84,64.47
N$24  (via drill 0.35)
  Top 0.152: v30.89,53.8 31.34,53.34 32.11,53.34 IC1.28 | v47.35,62.64 47.35,65.08 49.48,67.21 SV2.3
  Bottom 0.152: v30.89,53.8 30.28,54.41 30.28,55.02 37.9,62.64 v47.35,62.64
N$25  (via drill 0.35)
  Top 0.152: v34.09,53.8 32.26,53.8 IC1.29 | v44.6,49.99 44.6,48.31 R11.2
  Bottom 0.152: v34.09,53.8 36.53,53.8 40.64,57.91 43.38,57.91 45.97,60.5 | 45.97,60.5 46.58,61.11 50.7,61.11 51.31,61.72 51.31,68.12 49.63,69.8 SV2.4 | v44.6,49.99 44.6,57.3 46.58,59.28 46.58,59.89 45.97,60.5
N$26  (via drill 0.35)
  Top 0.152: v36.53,27.58 40.64,31.7 IC3.14
  Bottom 0.152: v36.53,27.58 31.95,27.58 28.3,23.93 26.16,23.93 23.11,20.88 23.11,19.96 26.47,16.61 26.47,15.39 K1.3
N$27
  Top 0.152: K1.6 27.84,20.42 29.21,19.05 IC3.8
N$28  (via drill 0.35)
  Top 0.152: v28.14,62.48 28.14,58.98 IC1.42 | v47.8,68.43 50.7,68.43 52.07,67.06 52.07,37.64 46.13,31.7 45.06,31.7 41.25,27.89 v37.74,27.89
  Bottom 0.152: v28.14,62.48 29.21,62.48 35.76,69.04 35.76,71.02 36.68,71.93 44.6,71.93 47.8,68.73 v47.8,68.43 | v37.74,27.89 35,25.15 30.58,25.15 28.14,22.71 28.14,17.68 30.12,15.7 30.12,9.45 27.69,7.01 27.69,5.18 27.08,4.57 23.72,4.57 22.66,5.64 22.66,13.11 21.59,14.17 21.59,15.24 K1.1
N$29
  Top 0.152: SPI.1 21.59,61.11 24.94,57.76 25.86,57.76 26.16,58.06 26.16,58.83 IC1.46
N$32  (via drill 0.35)
  Top 0.152: v31.5,67.51 31.5,57.91 31.19,57.61 31.19,57 31.34,56.84 32.11,56.84 IC1.35
  Bottom 0.152: v31.5,67.51 29.21,69.8 SPI.4
N$34
  Top 0.152: SPI.6 33.93,69.49 33.93,57.3 33.02,56.39 32.26,56.39 IC1.34
N$35  (via drill 0.35)
  Top 0.152: v33.48,53.04 33.48,52.88 33.02,52.43 32.26,52.43 IC1.26 | v29.67,54.71 v30.89,54.71 | v3.61,47.09 7.57,43.13 X5.5
  Bottom 0.152: v33.48,53.04 33.02,53.04 31.34,54.71 v30.89,54.71 | v29.67,54.71 27.99,54.71 26.47,56.24 23.72,56.24 21.89,58.06 9.55,58.06 9.4,58.22 5.89,58.22 3.61,55.93 v3.61,47.09
N$36  (via drill 0.35)
  Top 0.152: v31.5,45.26 30.73,46.03 30.73,47.85 32.11,49.23 32.11,51.82 IC1.25 | v29.06,44.04 v31.5,44.04
  Bottom 0.152: v31.5,44.04 v31.5,45.26 | v29.06,44.04 25.4,44.04 22.2,47.24 13.51,47.24 13.06,47.7 12.29,47.7 10.31,45.72 10.31,43.28 7.72,40.69 X5.4
N$37  (via drill 0.35)
  Top 0.152: v24.18,43.89 24.64,44.35 28.45,44.35 30.12,46.03 30.12,50.29 IC1.23 | v11.53,43.13 11.53,42.67 9.4,40.54 9.4,40.23 8.33,39.17 6.5,39.17 5.74,38.41 5.74,37.49 7.57,35.66 X5.2
  Bottom 0.152: v24.18,43.89 15.04,43.89 13.21,42.06 12.6,42.06 v11.53,43.13
N$38  (via drill 0.35)
  Top 0.152: v26.92,47.24 27.84,48.16 28.3,48.16 29.67,49.53 29.67,50.29 IC1.22 | v25.25,45.11 23.88,45.11 v23.42,44.65 | v12.9,42.67 12.45,42.67 11.23,41.45 11.23,36.58 7.72,33.07 X5.1
  Bottom 0.152: v26.92,47.24 26.92,46.79 v25.25,45.11 | v23.42,44.65 14.88,44.65 v12.9,42.67
N$39  (via drill 0.35)
  Top 0.152: v28.3,53.95 28.3,52.12 29.21,51.21 29.21,50.44 IC1.21
  Bottom 0.152: v28.3,53.95 27.08,55.17 8.33,55.17 X5.10
N$40  (via drill 0.35)
  Top 0.152: v29.82,56.84 30.73,55.93 32.11,55.93 IC1.33 | v13.21,58.67 12.14,58.67 v11.38,59.44 | v4.52,58.67 4.52,48.77 7.57,45.72 X5.6
  Bottom 0.152: v29.82,56.84 26.01,56.84 24.18,58.67 v13.21,58.67 | v11.38,59.44 5.28,59.44 v4.52,58.67
N$41  (via drill 0.35)
  Top 0.152: v32.26,63.09 32.26,57.46 IC1.36
  Bottom 0.152: v32.26,63.09 38.35,69.19 38.35,71.02 38.96,71.63 40.18,71.63 41.86,69.95 SPI.9
N$42  (via drill 0.35)
  Top 0.152: v31.8,73.15 30.73,72.09 30.73,69.19 30.12,68.58 30.12,60.2 30.58,59.74 30.58,58.98 IC1.37 | v40.64,73.76 44.45,69.95 SPI.10
  Bottom 0.152: v31.8,73.15 34.24,73.15 34.85,73.76 v40.64,73.76
N$43  (via drill 0.35)
  Top 0.152: C6.1 39.27,15.24 39.27,15.7 46.13,22.55 46.13,24.08 S3.4 | v21.89,53.65 22.05,53.8 23.57,53.8 IC1.8 | v12.45,23.47 13.67,23.47 14.58,24.38 16.41,24.38 17.02,24.99 17.02,26.21 15.34,27.89 X7.10
  Bottom 0.152: v21.89,53.65 14.43,53.65 13.36,54.71 6.81,54.71 5.44,53.34 5.44,27.89 6.5,26.82 14.12,26.82 X7.10 | v12.45,23.47 12.75,23.16 12.75,7.93 14.12,6.55 15.95,6.55 18.54,3.96 36.98,3.96 38.2,5.18 38.2,13.72 46.13,21.64 46.13,24.08 S3.4
N$44  (via drill 0.35)
  Top 0.152: v45.97,32.46 45.97,37.8 46.28,38.1 46.28,52.27 48.56,54.56 48.56,59.44 46.74,61.27 46.74,62.94 46.89,63.09 46.89,64.16 46.28,64.77 44.76,64.77 40.79,68.73 40.79,70.71 37.14,74.37 28.9,74.37 25.55,71.02 25.55,68.73 26.01,68.28 26.01,61.57 27.08,60.5 27.08,58.98 IC1.44 | v40.64,4.57 17.02,4.57 16.41,3.96 11.38,3.96 7.72,7.62 X6.2
  Bottom 0.152: v45.97,32.46 47.35,31.09 47.35,20.42 45.52,18.59 45.52,12.04 40.64,7.16 v40.64,4.57
N$45  (via drill 0.35)
  Top 0.152: v25.1,56.84 25.4,56.84 26.62,58.06 26.62,58.83 IC1.45 | v33.17,59.28 33.17,71.17 v35.15,73.15
  Bottom 0.152: v25.1,56.84 25.55,56.84 25.86,56.54 29.21,56.54 29.52,56.24 30.12,56.24 v33.17,59.28 | v35.15,73.15 49.78,73.15 53.59,69.34 53.59,24.08 48.41,18.9 48.41,8.23 43.54,3.35 7.11,3.35 5.74,4.72 5.74,8.23 7.57,10.06 X6.3
N$46  (via drill 0.35)
  Top 0.152: v22.05,57 22.2,56.84 23.57,56.84 IC1.2 | v12.6,39.32 13.36,39.32 13.97,39.93 13.97,40.84 16.26,43.13 R5.2
  Bottom 0.152: v22.05,57 20.52,55.47 10.31,55.47 8.79,57 6.5,57 5.13,55.63 5.13,26.52 | 5.13,26.52 5.13,24.08 5.44,23.77 5.44,14.94 7.57,12.8 X6.4 | v12.6,39.32 12.6,34.29 16.56,30.33 16.56,28.8 17.02,28.35 17.02,27.43 16.1,26.52 5.13,26.52
N$47  (via drill 0.35)
  Top 0.152: v20.68,56.54 20.83,56.39 23.57,56.39 IC1.3 | v3.91,22.1 3.91,21.49 5.44,19.96 5.44,17.22 7.42,15.24 X6.5 | IC4.2 21.59,33.68 23.27,32 23.27,31.39 22.05,30.17 20.52,30.17 18.24,27.89 18.24,21.49 18.85,20.88 18.85,20.27 17.47,18.9 10.62,18.9 v10.31,18.59
  Bottom 0.152: v20.68,56.54 13.36,56.54 12.14,57.76 9.4,57.76 9.25,57.91 6.05,57.91 4.22,56.08 4.22,23.93 3.91,23.62 v3.91,22.1 | v10.31,18.59 9.09,18.59 8.79,18.9 6.5,18.9 5.74,18.14 5.74,17.07 7.57,15.24 X6.5
N$48  (via drill 0.35)
  Top 0.152: v12.9,56.08 13.06,55.93 23.57,55.93 IC1.4 | v17.02,38.41 19.15,40.54 R6.1 | v14.88,36.27 11.53,36.27 9.4,34.14 9.4,32.61 5.74,28.96 5.74,27.58 6.81,26.52 8.79,26.52 10.01,25.3 10.01,20.42 10.31,20.12 10.31,19.51 8.64,17.83 7.72,17.83 X6.6
  Bottom 0.152: v12.9,56.08 10.16,56.08 8.94,57.3 6.35,57.3 4.83,55.78 4.83,23.93 5.13,23.62 5.13,12.95 6.5,11.58 8.79,11.58 9.4,12.19 9.4,16 X6.6 | v14.88,36.27 v17.02,38.41
N$49  (via drill 0.35)
  Top 0.152: v11.38,56.69 12.6,55.47 23.57,55.47 IC1.5 | v4.52,23.32 4.98,23.32 7.57,20.73 7.57,20.42 X6.7 5.74,18.44 5.74,17.37 6.35,16.76 8.79,16.76 9.25,17.22 11.53,17.22 11.84,16.92 11.84,16.46 14.12,14.17 16.41,14.17 17.32,15.09 17.32,17.53 24.18,24.38 24.18,28.65 29.21,33.68 IC4.7
  Bottom 0.152: v11.38,56.69 10.01,56.69 9.09,57.61 6.2,57.61 4.52,55.93 v4.52,23.32
N$50  (via drill 0.35)
  Top 0.152: v30.73,60.5 31.19,60.05 31.19,58.06 30.89,57.76 30.43,57.76 30.28,57.91 30.28,58.83 IC1.38 | v2.39,30.48 7.57,25.3 X6.9
  Bottom 0.152: v30.73,60.5 13.67,60.5 11.99,58.83 5.59,58.83 2.39,55.63 v2.39,30.48
N$51  (via drill 0.35)
  Top 0.152: v29.06,52.27 29.06,57 29.67,57.61 29.67,58.83 IC1.39 | v18.24,20.57 17.78,20.57 16.41,19.2 12.14,19.2 v10.62,20.73
  Bottom 0.152: v29.06,52.27 29.06,48.92 35,42.98 35,29.26 33.93,28.19 31.04,28.19 27.38,24.54 25.86,24.54 22.5,21.18 22.5,20.12 21.89,19.51 19.3,19.51 v18.24,20.57 | v10.62,20.73 10.16,20.73 8.03,22.86 X6.8
N$53  (via drill 0.35)
  Top 0.152: v26.92,57.46 27.69,56.69 27.69,53.95 27.08,53.34 23.72,53.34 IC1.9 | v3,24.84 3,24.23 2.69,23.93 2.69,22.25 5.13,19.81 5.13,12.95 6.81,11.28 8.79,11.28 12.14,7.93 12.14,6.71 13.67,5.18 15.19,5.18 X7.1
  Bottom 0.152: v26.92,57.46 25.86,57.46 24.03,59.28 12.9,59.28 12.14,58.52 5.74,58.52 3,55.78 v3,24.84
N$54  (via drill 0.35)
  Top 0.152: v21.13,52.88 23.57,52.88 IC1.10 | v10.31,27.43 10.31,21.95 v12.14,20.12 | v12.75,7.01 14.58,7.01 15.19,7.62 X7.2
  Bottom 0.152: v21.13,52.88 14.73,52.88 13.21,54.41 10.92,54.41 8.33,51.82 6.35,51.82 5.74,51.21 5.74,32 v10.31,27.43 | v12.14,20.12 12.14,7.62 v12.75,7.01
N$55
  Top 0.152: IC4.5 29.21,25.45 R3.2
N$56  (via drill 0.35)
  Top 0.152: v20.52,47.85 24.03,51.36 26.47,51.36 26.62,51.21 26.62,50.44 IC1.16 | v9.7,43.59 9.7,42.98 8.48,41.76 6.5,41.76 1.78,37.03 1.78,28.96 6.81,23.93 8.79,23.93 9.7,23.01 v9.7,19.81 | v11.23,16.61 15.19,12.65 X7.4
  Bottom 0.152: v20.52,47.85 19.3,47.85 19,47.55 13.67,47.55 13.21,48.01 12.14,48.01 9.7,45.57 v9.7,43.59 | v9.7,19.81 10.01,19.81 11.23,18.59 v11.23,16.61
N$57  (via drill 0.35)
  Top 0.152: v27.53,49.07 27.23,49.38 27.23,50.29 IC1.17 | v21.44,23.47 21.44,22.1 17.02,17.68 17.02,16.92 15.34,15.24 X7.5
  Bottom 0.152: v27.53,49.07 27.53,48.62 30.58,45.57 30.58,37.95 31.19,37.34 31.19,31.7 29.67,30.17 28.14,30.17 v21.44,23.47
N$58  (via drill 0.35)
  Top 0.152: v22.5,50.75 23.57,51.82 IC1.12 | v15.49,48.46 15.49,48.16 15.19,47.85 v15.19,45.57 | v19,26.82 19,26.52 20.07,25.45 R10.2 20.07,25.3 v18.85,24.08
  Bottom 0.152: v22.5,50.75 21.13,50.75 20.83,51.05 18.09,51.05 v15.49,48.46 | v15.19,45.57 14.88,45.57 13.06,43.74 11.23,43.74 10.92,43.43 10.92,41.91 13.36,39.47 13.36,33.98 16.87,30.48 16.87,28.96 v19,26.82 | v18.85,24.08 17.63,22.86 17.63,20.42 15.34,18.14 15.34,17.83 X7.6
N$59  (via drill 0.35)
  Top 0.152: v21.29,46.63 21.29,47.7 23.88,50.29 25.1,50.29 IC1.13 | X7.7 15.34,20.42 15.34,20.73 17.93,23.32 17.93,28.04 21.59,31.7 IC4.3
  Bottom 0.152: v21.29,46.63 22.35,46.63 24.79,44.2 24.79,35.05 21.59,31.85 IC4.3
N$60  (via drill 0.35)
  Top 0.152: v26.62,49.07 26.16,49.53 26.16,50.29 IC1.15
  Bottom 0.152: v26.62,49.07 30.28,45.41 30.28,37.8 30.89,37.19 30.89,33.53 29.21,31.85 IC4.6
N$61  (via drill 0.35)
  Top 0.152: v25.71,49.07 25.71,50.29 IC1.14 | v27.99,26.06 27.23,26.06 26.62,25.45 R3.1
  Bottom 0.152: v25.71,49.07 26.31,49.68 27.84,49.68 30.89,46.63 30.89,41 34.7,37.19 34.7,31.39 33.48,30.17 31.95,30.17 30.89,29.11 30.89,28.96 v27.99,26.06
N$62
  Bottom 0.152: K1.5 29.21,20.42 29.21,17.07 34.24,12.04 34.24,6.4 RS-232-2.3
N$63
  Top 0.152: R10.1 22.96,25.45 22.96,27.74 21.59,29.11 IC4.4
N$64
  Top 0.152: R7.1 33.02,15.24 33.02,17.07 34.7,18.75 34.7,21.95 33.48,23.16 31.95,23.16 31.34,23.77 31.34,26.97 31.95,27.58 35.61,27.58 36.22,26.97 38.96,26.97 39.57,27.58 44.6,27.58 44.76,27.43 S3.5
N$65
  Top 0.152: LED3.A 47.5,58.52 47.5,53.95 45.97,52.43 45.97,52.12 44.45,50.6 44.15,50.6 41.86,48.31 R11.1
N$66  (via drill 0.35)
  Top 0.152: v20.52,50.44 22.35,52.27 23.57,52.27 IC1.11 | v18.54,48.46 17.47,47.4 17.47,46.03 15.8,44.35 13.67,44.35 9.7,40.39 9.7,39.32 v9.4,39.01 | v9.4,29.26 11.84,26.82 11.84,23.16 v13.67,21.34
  Bottom 0.152: v18.54,48.46 v20.52,50.44 | v9.4,29.26 v9.4,39.01 | v13.67,21.34 13.67,21.03 13.36,20.73 13.36,12.04 X7.3
N$67
  Top 0.152: X4.4 47.19,9.75 46.43,9.75 45.97,10.21 45.97,14.33 49.48,17.83 SV3.1
N$68
  Top 0.152: SV3.2 45.67,16.46 45.67,9.6 46.28,8.99 47.19,8.99 X4.3
N$69
  Top 0.152: SV3.3 44.45,10.06 46.28,8.23 47.19,8.23 X4.2
VCC  (via drill 0.35)
  Top 0.152: C7.1 44.45,57.76 43.08,59.13 43.08,60.81 42.93,60.96 40.95,60.96 40.03,60.05 40.03,57.3 38.96,56.24 | 38.96,56.24 36.53,56.24 35.61,57.15 Q1.1 35.61,57.3 35.61,59.44 Q1.4 35.61,59.59 38.96,62.94 41.71,62.94 C9.1 | 16.26,35.81 16.26,34.44 16.87,33.83 17.02,33.83 17.78,33.07 JMP3.2 | 16.26,35.81 15.19,36.88 11.68,36.88 11.53,37.03 11.53,39.62 12.6,40.69 R8.1 | 36.98,40.54 31.5,40.54 C21.1 31.34,40.69 30.28,41.76 28.9,41.76 26.16,39.01 v23.42,39.01 | 36.98,40.54 40.64,36.88 IC3.16 | v16.71,36.27 16.26,35.81 | v38.96,54.86 38.96,56.24 | v41.86,45.57 38.51,45.57 36.98,44.04 36.98,40.54
  Bottom 0.152: v16.71,36.27 18.54,36.27 21.29,39.01 v23.42,39.01 | v38.96,54.86 38.96,48.46 v41.86,45.57
VDD  (via drill 0.35)
  Top 0.152: 17.78,31.24 17.78,30.63 18.09,30.33 18.09,28.65 17.32,27.89 17.32,24.84 15.34,22.86 X7.8 | 15.19,37.95 16.1,37.95 18.39,35.66 18.69,35.66 18.85,35.51 18.85,32.31 17.78,31.24 | 15.19,37.95 12.75,37.95 R8.2 | 17.78,31.24 JMP3.1 | 20.37,44.35 20.37,45.87 19.3,46.94 C12.1 19.15,47.09 19.15,50.6 C3.1 | 20.37,44.35 20.37,43.43 21.89,41.91 21.89,40.08 22.35,39.62 24.03,39.62 24.94,40.54 C5.1 | IC1.7 23.57,54.25 21.59,54.25 20.22,52.88 20.22,51.82 19.15,50.75 C3.1 | C3.1 19,50.75 16.56,50.75 C4.1 16.41,50.6 v15.04,50.6 | 15.19,37.95 15.19,41.61 15.49,41.91 17.17,41.91 18.09,42.82 18.09,44.2 18.24,44.35 20.37,44.35 | 35.46,55.47 34.39,54.41 32.26,54.41 IC1.30 | 35.46,55.47 36.07,55.47 36.53,55.02 36.53,51.97 35.46,50.9 | 35.46,50.9 31.95,47.4 31.95,47.09 R2.2 | SPI.7 36.83,63.86 34.54,61.57 34.54,56.39 35.46,55.47 | 45.21,7.16 47.19,7.16 X4.1 | 45.21,7.16 44.45,6.4 POWER.2 | C14.1 38.35,43.13 41.71,43.13 C15.1 41.86,43.28 42.93,44.35 v42.93,44.5 | IC2.3 35.61,47.4 38.05,47.4 IC2.4 38.2,47.4 39.12,47.4 v40.03,48.31 | SV1.2 47.19,40.84 47.19,36.88 C11.1 | v42.01,54.86 42.01,57 C2.1 | v35.61,50.9 35.46,50.9 | 45.21,7.16 43.23,9.14 43.23,11.43 TP2.TP
  Bottom 0.152: 11.68,50.75 7.72,50.75 X5.8 | 11.68,50.75 12.45,49.99 14.43,49.99 v15.04,50.6 | 42.01,48.31 42.01,46.33 43.38,44.96 | 42.01,48.31 v42.01,54.86 | 43.38,44.96 47.65,40.69 47.65,40.23 48.26,39.62 50.7,39.62 | 50.7,39.62 51.31,40.23 51.31,41.45 49.63,43.13 SV1.2 | 42.01,48.31 v40.03,48.31 | 43.38,44.96 v42.93,44.5 42.01,44.5 v35.61,50.9 34.7,50.9 32.41,53.19 25.4,53.19 24.49,52.27 14.88,52.27 13.06,54.1 12.29,54.1 11.68,53.49 11.68,50.75 | POWER.2 44.45,10.52 48.11,14.17 48.11,26.52 52.98,31.39 52.98,37.34 50.7,39.62
VSS  (via drill 0.35)
  Top 0.152: 12.75,33.68 14.43,32 14.58,32 15.19,31.39 JMP2.1 15.19,31.24 13.36,29.41 13.36,27.58 15.19,25.76 15.19,25.45 X7.9 | 12.75,33.68 12.75,34.29 R9.2 12.75,33.68 | 12.75,33.68 10.92,33.68 7.72,30.48 7.72,28.04 X6.10 | 50.55,16.61 49.78,15.85 49.78,12.65 47.65,10.52 47.35,10.52 X4.5 | 50.55,19.66 50.55,24.08 S3.2 50.55,24.23 48.56,26.21 48.56,30.94 S3.6 | 50.55,19.66 50.55,16.61 | 22.05,11.43 25.4,8.08 27.53,8.08 27.99,7.62 | 27.99,7.62 29.21,6.4 RS232-1.1 | 27.99,7.62 28.14,7.62 31.95,11.43 C17.2 32.11,11.43 33.17,10.36 35,10.36 38.96,6.4 39.27,6.4 RS-232-2.1 39.42,6.4 41.86,6.4 POWER.1 42.01,6.4 42.01,15.24 C6.2 42.16,15.24 42.16,17.68 44.15,19.66 50.55,19.66 | 22.05,11.43 22.5,11.89 22.5,15.7 21.59,16.61 21.59,20.42 K1.8 | 22.05,11.43 C18.2 | C5.2 23.27,40.69 23.27,41 25.4,43.13 C1.2 25.55,43.13 28.6,43.13 29.36,42.37 33.17,42.37 34.7,43.89 | 34.7,43.89 34.7,46.18 | 34.7,46.18 34.7,47.7 35.15,48.16 35.46,48.16 IC2.2 35.46,48.31 35.46,49.07 IC2.1 35.61,49.23 36.22,49.23 40.34,53.34 C16.2 41.86,53.34 41.86,53.8 43.08,55.02 43.08,58.67 42.01,59.74 C2.2 41.86,59.74 v40.64,58.52 | 34.7,43.89 35.31,43.28 C14.2 34.7,43.89 | 34.7,46.18 42.16,46.18 44.45,43.89 44.45,43.28 C15.2 44.45,43.13 44.45,36.88 C11.2 44.3,36.73 43.99,36.42 v43.99,35.36 | 8.33,64.92 8.94,64.92 S4.6 | 8.33,64.92 6.35,64.92 X3.1 | S4.2 15.8,66.9 11.38,66.9 9.25,64.77 S4.6 | IC1.6 23.57,54.86 20.52,54.86 19.15,53.49 C3.2 19,53.49 16.56,53.49 C4.2 16.41,53.34 14.43,51.36 | 14.43,51.36 14.43,50.29 14.73,49.99 14.88,49.99 16.26,48.62 16.26,47.09 C12.2 | 9.4,53.34 11.07,53.34 12.29,52.12 13.67,52.12 14.43,51.36
  Top 0.152: 9.4,53.34 X5.9 | 8.33,64.92 8.33,57.46 9.4,56.39 9.4,53.34 | 8.33,64.92 S4.6 | 36.37,71.63 35.76,71.02 35.76,69.04 34.24,67.51 34.24,55.32 33.78,54.86 32.26,54.86 IC1.31 | 36.37,71.63 37.59,71.63 SPI.8 | SV2.1 49.63,62.18 51,60.81 51,58.67 LED3.C 51.16,58.52 51.31,58.37 51.31,47.85 49.63,46.18 49.63,45.72 SV1.3 | v35.76,54.86 35.46,54.56 35.46,53.34 C13.2 | v33.93,73.76 35.46,73.76 36.37,72.85 36.37,71.63 | 50.55,16.61 51.77,15.39 52.68,15.39 TP1.TP
  Bottom 0.152: K1.8 21.44,20.42 21.44,22.4 18.54,25.3 15.34,25.3 X7.9 | v35.76,54.86 37.14,54.86 40.79,58.52 | 40.79,58.52 44.3,62.03 47.95,62.03 | 47.95,62.03 49.33,62.03 SV2.1 | SPI.8 45.97,63.25 47.65,63.25 47.95,62.94 47.95,62.03 | v33.93,73.76 22.35,73.76 15.95,67.36 15.95,67.06 S4.2 | 40.79,58.52 v40.64,58.52 | v43.99,35.36 44.15,35.36 48.41,31.09 S3.6

### Text on the board
Top: 1.6 SECS GEM Tester | These are the controllers you are looking for!
200bmp: /fred/Downloads/mchp.bmp